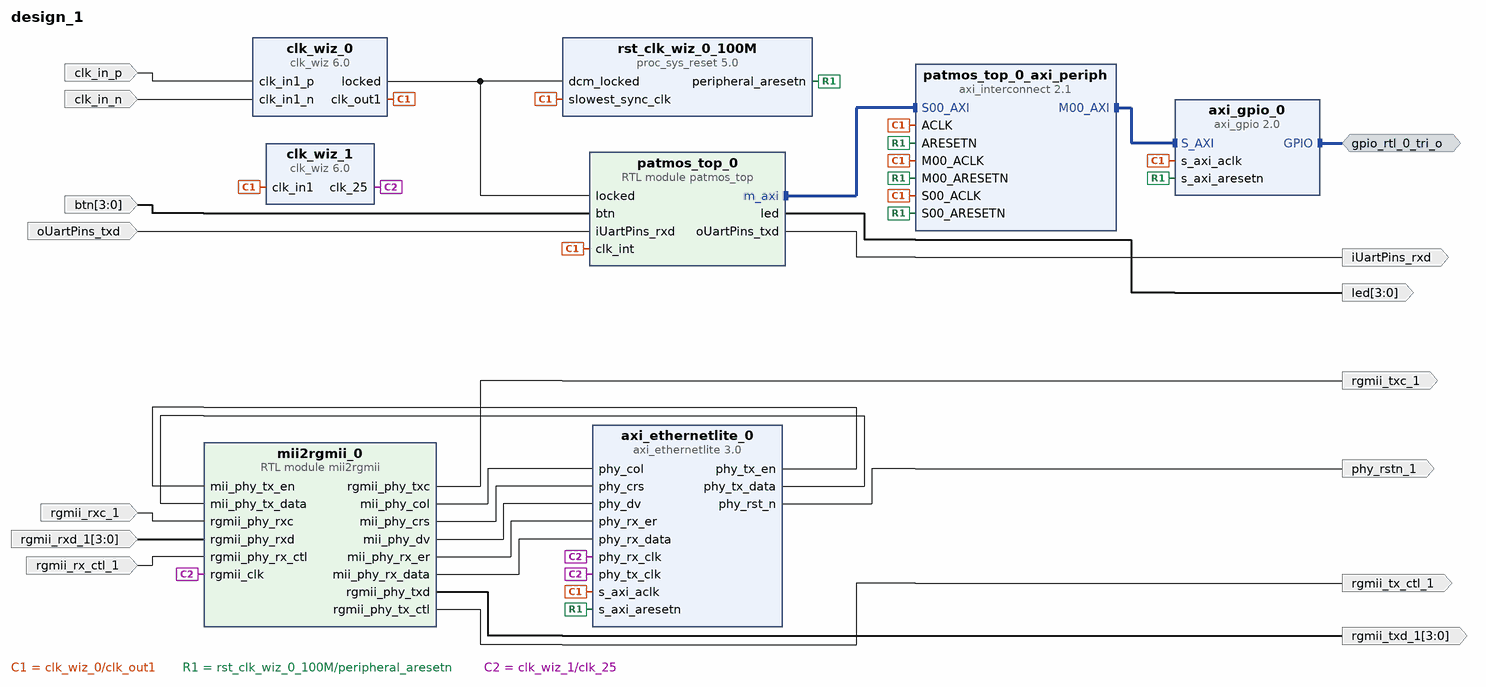
[diagram p0: block diagram of the top level]
# Vivado block design design_1, xc7k325tffg676-1, Vivado 2019.2
create_bd_design design_1

create_bd_intf_port -mode Master -vlnv xilinx.com:interface:gpio_rtl:1.0 gpio_rtl_0_tri_o
create_bd_port -dir I -type clk clk_in_p
set_property -dict {CONFIG.FREQ_HZ 200000000} [get_bd_ports clk_in_p]
create_bd_port -dir I -type clk clk_in_n
set_property -dict {CONFIG.FREQ_HZ 200000000} [get_bd_ports clk_in_n]
create_bd_port -dir I -from 3 -to 0 btn
create_bd_port -dir O -from 3 -to 0 led
create_bd_port -dir I oUartPins_txd
create_bd_port -dir O iUartPins_rxd
create_bd_port -dir O -from 3 -to 0 rgmii_txd_1
create_bd_port -dir I -from 3 -to 0 rgmii_rxd_1
create_bd_port -dir O rgmii_tx_ctl_1
create_bd_port -dir O rgmii_txc_1
create_bd_port -dir I rgmii_rxc_1
create_bd_port -dir I rgmii_rx_ctl_1
create_bd_port -dir O -type rst phy_rstn_1

create_bd_cell -type ip -vlnv xilinx.com:ip:clk_wiz:6.0 clk_wiz_0
set_property -dict [list \
  CONFIG.CLKIN1_JITTER_PS 50.0 \
  CONFIG.CLKOUT1_JITTER 112.316 \
  CONFIG.CLKOUT1_PHASE_ERROR 89.971 \
  CONFIG.CLKOUT1_REQUESTED_OUT_FREQ 100.000 \
  CONFIG.MMCM_CLKFBOUT_MULT_F 5.000 \
  CONFIG.MMCM_CLKIN1_PERIOD 5.000 \
  CONFIG.MMCM_CLKIN2_PERIOD 10.0 \
  CONFIG.MMCM_CLKOUT0_DIVIDE_F 10.000 \
  CONFIG.PRIM_IN_FREQ 200.000 \
  CONFIG.PRIM_SOURCE Differential_clock_capable_pin \
  CONFIG.USE_RESET false \
] [get_bd_cells clk_wiz_0]
create_bd_cell -type ip -vlnv xilinx.com:ip:axi_ethernetlite:3.0 axi_ethernetlite_0
set_property -dict [list \
  CONFIG.C_INCLUDE_INTERNAL_LOOPBACK 0 \
  CONFIG.C_INCLUDE_MDIO 0 \
  CONFIG.C_RX_PING_PONG 0 \
  CONFIG.C_TX_PING_PONG 0 \
] [get_bd_cells axi_ethernetlite_0]
create_bd_cell -type ip -vlnv xilinx.com:ip:axi_interconnect:2.1 patmos_top_0_axi_periph
set_property -dict {CONFIG.NUM_MI 1} [get_bd_cells patmos_top_0_axi_periph]
create_bd_cell -type ip -vlnv xilinx.com:ip:proc_sys_reset:5.0 rst_clk_wiz_0_100M
create_bd_cell -type ip -vlnv xilinx.com:ip:clk_wiz:6.0 clk_wiz_1
set_property -dict [list \
  CONFIG.CLKIN1_JITTER_PS 100.0 \
  CONFIG.CLKOUT1_JITTER 181.828 \
  CONFIG.CLKOUT1_PHASE_ERROR 104.359 \
  CONFIG.CLKOUT1_REQUESTED_OUT_FREQ 25.000 \
  CONFIG.CLKOUT1_USED true \
  CONFIG.CLKOUT2_JITTER 175.402 \
  CONFIG.CLKOUT2_PHASE_ERROR 98.575 \
  CONFIG.CLKOUT2_REQUESTED_OUT_FREQ 25.000 \
  CONFIG.CLKOUT2_USED false \
  CONFIG.CLK_OUT1_PORT clk_25 \
  CONFIG.CLK_OUT2_PORT clk_rgmii \
  CONFIG.MMCM_CLKFBOUT_MULT_F 9.125 \
  CONFIG.MMCM_CLKIN1_PERIOD 10.000 \
  CONFIG.MMCM_CLKIN2_PERIOD 10.000 \
  CONFIG.MMCM_CLKOUT0_DIVIDE_F 36.500 \
  CONFIG.MMCM_CLKOUT1_DIVIDE 1 \
  CONFIG.NUM_OUT_CLKS 1 \
  CONFIG.PRIM_IN_FREQ 100.000 \
  CONFIG.PRIM_SOURCE Single_ended_clock_capable_pin \
  CONFIG.USE_RESET false \
] [get_bd_cells clk_wiz_1]
create_bd_cell -type module -reference mii2rgmii mii2rgmii_0
create_bd_cell -type ip -vlnv xilinx.com:ip:axi_gpio:2.0 axi_gpio_0
set_property -dict {CONFIG.C_ALL_OUTPUTS 1 CONFIG.C_GPIO_WIDTH 4} [get_bd_cells axi_gpio_0]
create_bd_cell -type module -reference patmos_top patmos_top_0

# ---- connections ----

connect_bd_intf_net [get_bd_intf_pins axi_gpio_0/S_AXI] [get_bd_intf_pins patmos_top_0_axi_periph/M00_AXI]
connect_bd_intf_net [get_bd_intf_ports gpio_rtl_0_tri_o] [get_bd_intf_pins axi_gpio_0/GPIO]
connect_bd_intf_net [get_bd_intf_pins patmos_top_0/m_axi] [get_bd_intf_pins patmos_top_0_axi_periph/S00_AXI]
connect_bd_net [get_bd_pins clk_wiz_0/clk_out1] \
  [get_bd_pins patmos_top_0_axi_periph/S00_ACLK] [get_bd_pins rst_clk_wiz_0_100M/slowest_sync_clk] \
  [get_bd_pins axi_ethernetlite_0/s_axi_aclk] [get_bd_pins patmos_top_0_axi_periph/M00_ACLK] \
  [get_bd_pins patmos_top_0_axi_periph/ACLK] [get_bd_pins clk_wiz_1/clk_in1] [get_bd_pins axi_gpio_0/s_axi_aclk] \
  [get_bd_pins patmos_top_0/clk_int]
connect_bd_net [get_bd_pins clk_wiz_0/locked] [get_bd_pins rst_clk_wiz_0_100M/dcm_locked] [get_bd_pins patmos_top_0/locked]
connect_bd_net [get_bd_ports clk_in_p] [get_bd_pins clk_wiz_0/clk_in1_p]
connect_bd_net [get_bd_ports clk_in_n] [get_bd_pins clk_wiz_0/clk_in1_n]
connect_bd_net [get_bd_ports btn] [get_bd_pins patmos_top_0/btn]
connect_bd_net [get_bd_pins patmos_top_0/led] [get_bd_ports led]
connect_bd_net [get_bd_ports oUartPins_txd] [get_bd_pins patmos_top_0/iUartPins_rxd]
connect_bd_net [get_bd_pins patmos_top_0/oUartPins_txd] [get_bd_ports iUartPins_rxd]
connect_bd_net [get_bd_pins rst_clk_wiz_0_100M/peripheral_aresetn] \
  [get_bd_pins patmos_top_0_axi_periph/S00_ARESETN] [get_bd_pins axi_ethernetlite_0/s_axi_aresetn] \
  [get_bd_pins patmos_top_0_axi_periph/M00_ARESETN] [get_bd_pins patmos_top_0_axi_periph/ARESETN] \
  [get_bd_pins axi_gpio_0/s_axi_aresetn]
connect_bd_net -net mii2rgmii_0_phy_col [get_bd_pins mii2rgmii_0/mii_phy_col] [get_bd_pins axi_ethernetlite_0/phy_col]
connect_bd_net -net mii2rgmii_0_phy_crs [get_bd_pins mii2rgmii_0/mii_phy_crs] [get_bd_pins axi_ethernetlite_0/phy_crs]
connect_bd_net -net mii2rgmii_0_phy_dv [get_bd_pins mii2rgmii_0/mii_phy_dv] [get_bd_pins axi_ethernetlite_0/phy_dv]
connect_bd_net -net mii2rgmii_0_phy_rx_er [get_bd_pins mii2rgmii_0/mii_phy_rx_er] [get_bd_pins axi_ethernetlite_0/phy_rx_er]
connect_bd_net -net mii2rgmii_0_phy_rx_data [get_bd_pins mii2rgmii_0/mii_phy_rx_data] [get_bd_pins axi_ethernetlite_0/phy_rx_data]
connect_bd_net [get_bd_pins axi_ethernetlite_0/phy_tx_en] [get_bd_pins mii2rgmii_0/mii_phy_tx_en]
connect_bd_net [get_bd_pins axi_ethernetlite_0/phy_tx_data] [get_bd_pins mii2rgmii_0/mii_phy_tx_data]
connect_bd_net -net rgmii_rxc_1_1 [get_bd_ports rgmii_rxc_1] [get_bd_pins mii2rgmii_0/rgmii_phy_rxc]
connect_bd_net -net rgmii_rxd_1_1 [get_bd_ports rgmii_rxd_1] [get_bd_pins mii2rgmii_0/rgmii_phy_rxd]
connect_bd_net -net rgmii_rx_ctl_1_1 [get_bd_ports rgmii_rx_ctl_1] [get_bd_pins mii2rgmii_0/rgmii_phy_rx_ctl]
connect_bd_net -net mii2rgmii_0_TXC [get_bd_pins mii2rgmii_0/rgmii_phy_txc] [get_bd_ports rgmii_txc_1]
connect_bd_net -net mii2rgmii_0_RGMII_TXD [get_bd_pins mii2rgmii_0/rgmii_phy_txd] [get_bd_ports rgmii_txd_1]
connect_bd_net -net mii2rgmii_0_TX_CTL [get_bd_pins mii2rgmii_0/rgmii_phy_tx_ctl] [get_bd_ports rgmii_tx_ctl_1]
connect_bd_net [get_bd_pins axi_ethernetlite_0/phy_rst_n] [get_bd_ports phy_rstn_1]
connect_bd_net [get_bd_pins clk_wiz_1/clk_25] \
  [get_bd_pins axi_ethernetlite_0/phy_rx_clk] [get_bd_pins axi_ethernetlite_0/phy_tx_clk] [get_bd_pins mii2rgmii_0/rgmii_clk]

# ---- address map ----
assign_bd_address -offset 0x000 -range 4K -target_address_space [get_bd_addr_spaces patmos_top_0/m_axi] [get_bd_addr_segs axi_gpio_0/S_AXI/Reg]

validate_bd_design
save_bd_design
